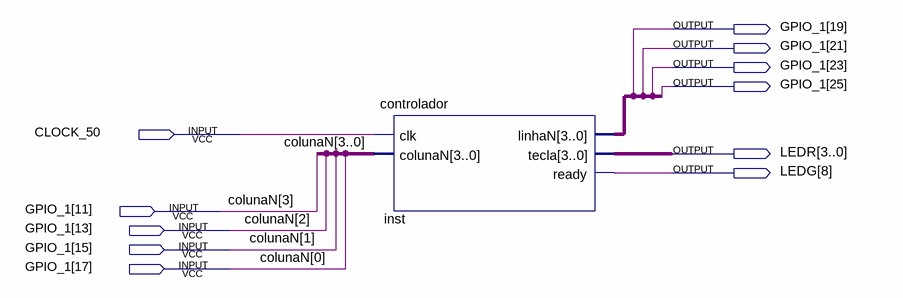
[diagram p0: schematic sheet]
// Quartus schematic projeto_final.bdf as structural Verilog: 1 symbols, 11 pins
module projeto_final (
  input  CLOCK_50,
  inout  [25:11] GPIO_1,
  output [3:0] LEDR,
  output [8:8] LEDG
);

  wire [3:0] inst_linhan;

  controlador inst (
    .clk(CLOCK_50), .colunaN({GPIO_1[11], GPIO_1[13], GPIO_1[15], GPIO_1[17]}), .linhaN(inst_linhan),
    .tecla(LEDR), .ready(LEDG[8]));

  // Other names for the same wires on the sheet: colunaN[3:0] = {GPIO_1[11], GPIO_1[13], GPIO_1[15], GPIO_1[17]}
endmodule
